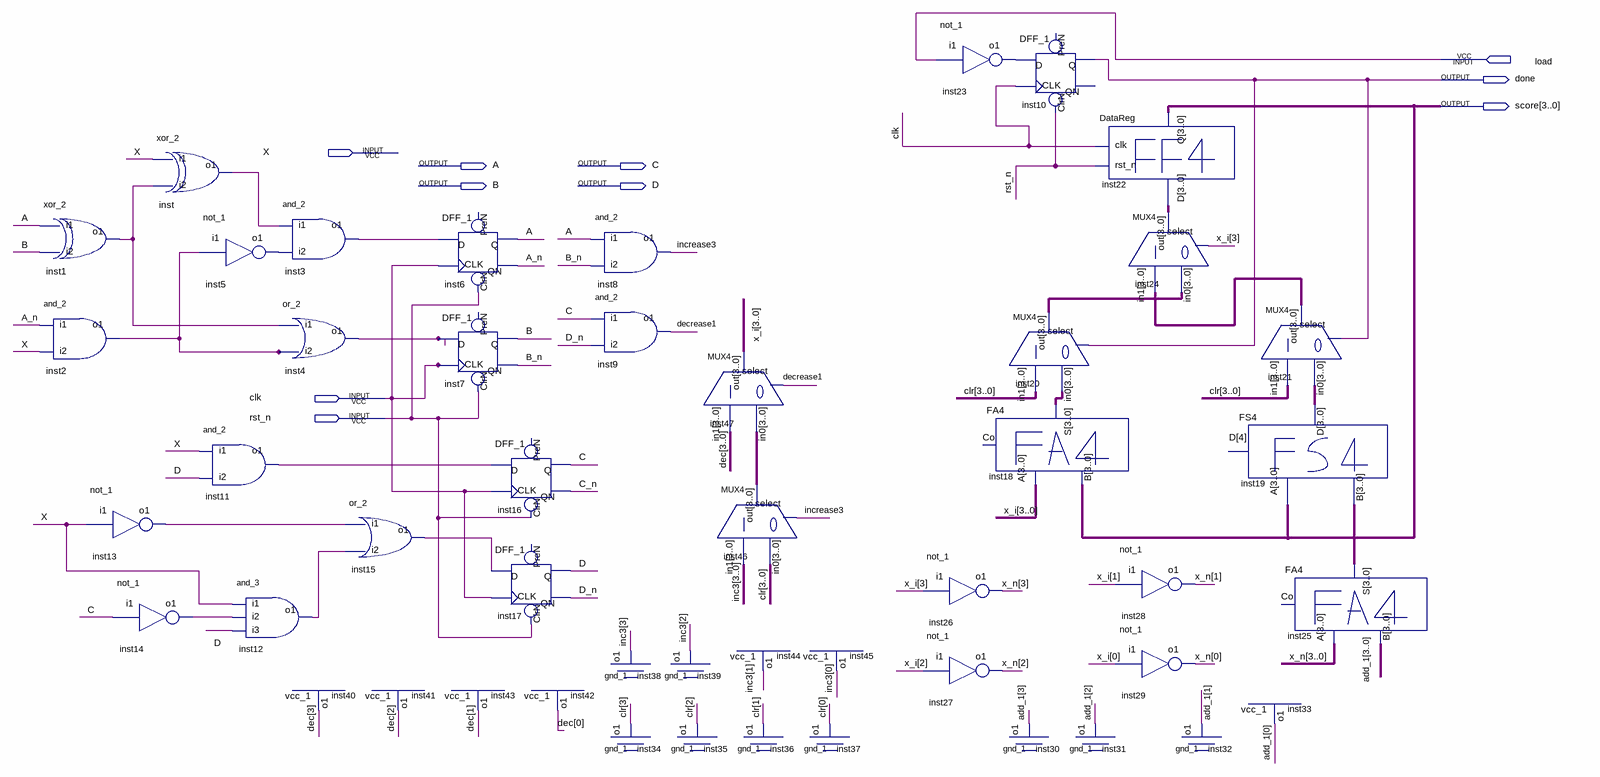
[diagram p0: schematic sheet]
// Quartus schematic WSC.bdf as structural Verilog: 48 symbols, 10 pins
module WSC (
  input  load,
  input  X,
  input  clk,
  input  rst_n,
  output done,
  output [3:0] score,
  output A,
  output C,
  output B,
  output D
);

  wire A_n, B_n, C_n, D_n, decrease1, increase3, inst1_o1, inst2_o1, inst3_o1, inst4_o1, inst5_o1, inst11_o1,
       inst12_o1, inst13_o1, inst14_o1, inst15_o1, inst23_o1, inst_o1;
  wire [3:0] add_1, clr, dec, inc3, inst18_s, inst19_d, inst20_out, inst21_out, inst24_out, inst25_s,
       inst46_out, x_i, x_n;
  wire [4:0] inst19_d_open;  // unused outputs

  xor_2 inst1 (.i1(A), .i2(B), .o1(inst1_o1));
  and_2 inst2 (.i1(A_n), .i2(X), .o1(inst2_o1));
  not_1 inst13 (.i1(X), .o1(inst13_o1));
  xor_2 inst (.i1(X), .i2(inst1_o1), .o1(inst_o1));
  not_1 inst14 (.i1(C), .o1(inst14_o1));
  not_1 inst5 (.i1(inst2_o1), .o1(inst5_o1));
  and_2 inst11 (.i1(X), .i2(D), .o1(inst11_o1));
  and_3 inst12 (.i1(X), .i2(inst14_o1), .i3(D), .o1(inst12_o1));
  and_2 inst3 (.i1(inst_o1), .i2(inst5_o1), .o1(inst3_o1));
  or_2 inst4 (.i1(inst1_o1), .i2(inst2_o1), .o1(inst4_o1));
  vcc_1 inst40 (.o1(dec[3]));
  or_2 inst15 (.i1(inst13_o1), .i2(inst12_o1), .o1(inst15_o1));
  vcc_1 inst41 (.o1(dec[2]));
  DFF_1 inst6 (.CLK(clk), .D(inst3_o1), .ClrN(rst_n), .QN(A_n), .Q(A));  // open: PreN
  DFF_1 inst7 (.CLK(clk), .D(inst4_o1), .ClrN(rst_n), .QN(B_n), .Q(B));  // open: PreN
  vcc_1 inst43 (.o1(dec[1]));
  DFF_1 inst16 (.CLK(clk), .D(inst11_o1), .ClrN(rst_n), .QN(C_n), .Q(C));  // open: PreN
  DFF_1 inst17 (.CLK(clk), .D(inst15_o1), .ClrN(rst_n), .QN(D_n), .Q(D));  // open: PreN
  vcc_1 inst42 (.o1(dec[0]));
  and_2 inst8 (.i1(A), .i2(B_n), .o1(increase3));
  and_2 inst9 (.i1(C), .i2(D_n), .o1(decrease1));
  gnd_1 inst38 (.o1(inc3[3]));
  gnd_1 inst34 (.o1(clr[3]));
  gnd_1 inst39 (.o1(inc3[2]));
  gnd_1 inst35 (.o1(clr[2]));
  MUX4 inst47 (.in1(dec), .in0(inst46_out), .select(decrease1), .out(x_i));
  MUX4 inst46 (.in1(inc3), .in0(clr), .select(increase3), .out(inst46_out));
  vcc_1 inst44 (.o1(inc3[1]));
  gnd_1 inst36 (.o1(clr[1]));
  vcc_1 inst45 (.o1(inc3[0]));
  gnd_1 inst37 (.o1(clr[0]));
  not_1 inst23 (.i1(load), .o1(inst23_o1));
  not_1 inst26 (.i1(x_i[3]), .o1(x_n[3]));
  not_1 inst27 (.i1(x_i[2]), .o1(x_n[2]));
  MUX4 inst20 (.in1(clr), .in0(inst18_s), .select(done), .out(inst20_out));
  FA4 inst18 (.A(x_i), .B(score), .S(inst18_s));  // open: Co
  gnd_1 inst30 (.o1(add_1[3]));
  DFF_1 inst10 (.CLK(clk), .D(inst23_o1), .ClrN(rst_n), .Q(done));  // open: PreN, QN
  DataReg inst22 (.clk(clk), .rst_n(rst_n), .D(inst24_out), .Q(score));
  not_1 inst28 (.i1(x_i[1]), .o1(x_n[1]));
  not_1 inst29 (.i1(x_i[0]), .o1(x_n[0]));
  gnd_1 inst31 (.o1(add_1[2]));
  MUX4 inst24 (.in1(inst21_out), .in0(inst20_out), .select(x_i[3]), .out(inst24_out));
  gnd_1 inst32 (.o1(add_1[1]));
  MUX4 inst21 (.in1(clr), .in0(inst19_d), .select(done), .out(inst21_out));
  FS4 inst19 (.A(score), .B(inst25_s), .D({inst19_d_open[4], inst19_d}));
  vcc_1 inst33 (.o1(add_1[0]));
  FA4 inst25 (.A(x_n), .B(add_1), .S(inst25_s));  // open: Co
endmodule
